# Altium project AM3359.PRJPCB (part 2 of 2)

## Sheet Sheet7.SchDoc
size B
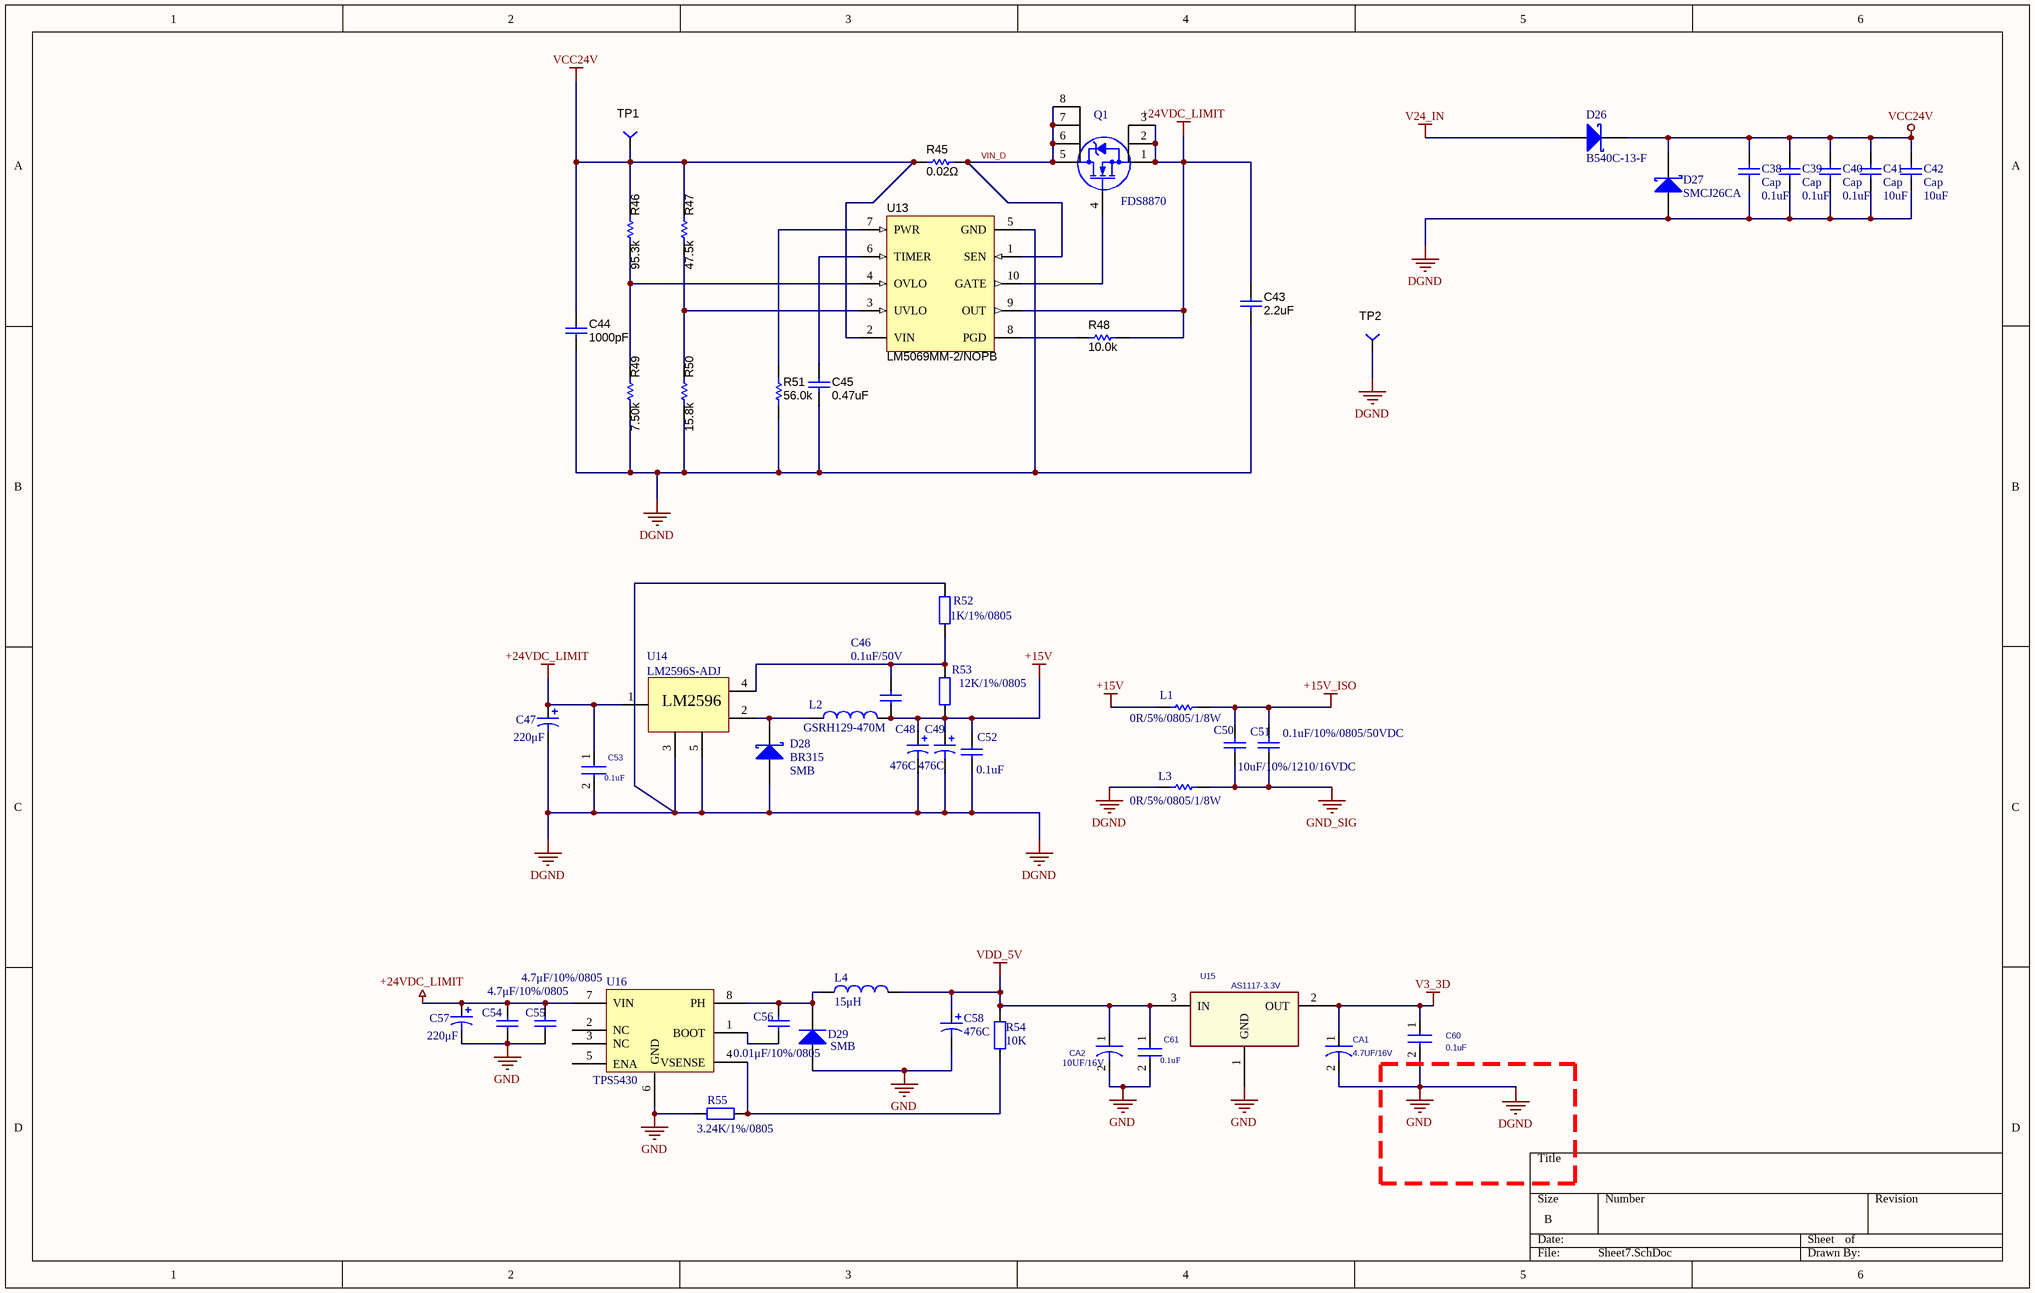
[diagram p6: Sheet7.SchDoc]

### Parts
C38  Cap  value 0.1uF  [0805_cap]
C39  Cap  value 0.1uF  [0805_cap]
C40  Cap  value 0.1uF  [0805_cap]
C41  Cap  value 10uF  [0805_cap]
C42  Cap  value 10uF  [0805_cap]
C43  ValueDisplayed: 2.2uF  [1210]  (hidden comment: GRM32ER72A225KA35L)
C44  ValueDisplayed: 1000pF  [0805_cap]  (hidden comment: 06031C102JAT2A)
C45  ValueDisplayed: 0.47uF  [0805_cap]  (hidden comment: UMK107ABJ474KA-T)
C46  0.1uF/50V  [C-0805]
C47  220μF  [CZ3.0/6.5]
C48  476C  [7343-43]
C49  476C  [7343-43]
C50  10uF/10%/1210/16VDC  [C-1210]
C51  0.1uF/10%/0805/50VDC  [C-0805]
C52  0.1uF  [C-0805]
C53  0.1uF  [0805_CAP]
C54  4.7μF/10%/0805  [0805_CAP]
C55  4.7μF/10%/0805  [0805_CAP]
C56  0.01μF/10%/0805  [0805_CAP]
C57  220μF  [CZ3.0/6.5]
C58  476C  [7343-43]
C60  0.1uF  [0805_CAP]
C61  0.1uF  [0805_CAP]
CA1  4.7UF/16V  [3528cap]
CA2  10UF/16V  [3528cap]
D26  B540C-13-F  [SMB1]
D27  SMCJ26CA  [SMB1]
D28  D Schottky  [SMB]  (value not drawn)
D29  SMB  [SMB]
L1  0R/5%/0805/1/8W  [R-0805]
L2  GSRH129-470M  [GSDS104C2]
L3  0R/5%/0805/1/8W  [R-0805]
L4  15μH  [GSDS104C2]
Q1  FDS8870  [SO-G8]
R45  value 0.02Ω  [1206]  (hidden comment: PRL1632-R020-F-T1)
R46  value 95.3k  [0805]  (hidden comment: CRCW060395K3FKEA)
R47  value 47.5k  [0805]  (hidden comment: CRCW060347K5FKEA)
R48  value 10.0k  [0805]  (hidden comment: CRCW060310K0FKEA)
R49  value 7.50k  [0805]  (hidden comment: CRCW06037K50FKEA)
R50  value 15.8k  [0805]  (hidden comment: CRCW060315K8FKEA)
R51  value 56.0k  [0805]  (hidden comment: RG1608P-563-B-T5)
R52  1K/1%/0805  [0805]
R53  12K/1%/0805  [0805]
R54  10K  [0805]
R55  3.24K/1%/0805  [0805]
TP1  TP-040_RND  [TP-040_RND]  (value not drawn)
TP2  TP-040_RND  [TP-040_RND]  (value not drawn)
U13  LM5069MM-2/NOPB  [MUB10A_N]
U14  LM2596S-ADJ  [TO-263(S)-5]
U15  AS1117-3.3V  [SOT-223]
U16  TPS5430  [SO-G8]

### Nets
+15V: C46.2 C48.1 C49.1 C52.2 L1.1 L2.2 R53.1
+15V_ISO: C50.2 C51.2 L1.2
+24VDC_LIMIT: C43.1 C47.1 C53.1 C54.2 C55.2 C57.1 Q1.1(S) Q1.2(S) Q1.3(S) R48.1 U13.9(OUT) U14.1 U16.7(VIN)
DGND: C38.1 C39.1 C40.1 C41.1 C42.1 C43.2 C44.2 C45.2 C47.2 C48.2 C49.2 C52.1 C53.2 C54.1 C55.1 C57.2 C58.2 C60.2 C61.2 CA1.2 CA2.2 D27.1(A) D28.1(A) D29.1(A) L3.1 R49.1 R50.1 R51.1 R52.2 R55.2 TP2.1 U13.5(GND) U14.3 U14.5 U15.1(GND) U16.6(GND)  [also labelled GND]
GND_SIG: C50.1 C51.1 L3.2
V3_3D: C60.1 CA1.1 U15.2(OUT)
V24_IN: D26.1(A)
VCC24V: C38.2 C39.2 C40.2 C41.2 C42.2 C44.1 D26.2(K) D27.2(K) R45.1 R46.2 R47.2 TP1.1 U13.2(VIN)
VDD_5V: C58.1 C61.1 CA2.1 L4.2 R54.2 U15.3(IN)
VIN_D: Q1.5(D) Q1.6(D) Q1.7(D) Q1.8(D) R45.2 U13.1(SEN)
NetC45_1: C45.1 U13.6(TIMER)
NetC46_1: C46.1 R52.1 R53.2 U14.4
NetC56_1: C56.1 U16.1(BOOT)
NetC56_2: C56.2 D29.2(K) L4.1 U16.8(PH)
NetD28_2: D28.2(K) L2.1 U14.2
NetQ1_4: Q1.4(G) U13.10(GATE)
NetR46_1: R46.1 R49.2 U13.4(OVLO)
NetR47_1: R47.1 R50.2 U13.3(UVLO)
NetR48_2: R48.2 U13.8(PGD)
NetR51_2: R51.2 U13.7(PWR)
NetR54_1: R54.1 R55.1 U16.4(VSENSE)

Not connected (* = marked no-connect by the designer): U16 2(NC) 3(NC) 5(ENA)

### Notes on the sheet
- (in symbol D Schottky) BR315; SMB
- (in symbol SWITCHING) LM2596

### Library data of the parts
C38-C42 C46 C52 = Cap: Capacitor; LatestRevisionDate: 17-Jul-2002
  C38-C42: Published: 8-Jun-2000; LatestRevisionNote: Re-released for DXP Platform.; PackageReference: RAD-0.3; Publisher: Altium Limited
C43 = GRM32ER72A225KA35L: CAP, CERM, 2.2uF, 100V, +/-10%, X7R, 1210; Manufacturer: MuRata; Polarized: N; CompType: Capacitor; U/M: EA; Cap_F: 0.0000022; Tolerance_%: 10; ESR_Ohm: 0.007; Value1: 0.007 ohm; VDC_V: 100; IRMS_A: 4.4; TaMin_C: -55; TaMax_C: 125; SymbolVersion: 2008-07-09; Value: 2.2uF; PartNumber: GRM32ER72A225KA35L; PackageReference: 1210; RoHS: Y; Value2: 100V; MountType: SMT; Technology: Ceramic; TempCo: X7R; Cap_Case: 1210; Published: 2008-06-19; Publisher: Texas Instruments; LatestRevisionDate: 2013-11-21; ComponentLink1Description: Datasheet link; ComponentLink1URL: http://search.murata.co.jp/Ceramy/PnsearchViewAction.do?HnOFG=ON&HnNFG=ON&SEL_CNT=50&sLang=en&sKey=GRM32ER72A225KA35L&x=9&y=9&search=startwith; Supplier 1: Digi-Key; Supplier Part Number 1: 490-3385-1-ND; Supplier 2: Mouser; Supplier Part Number 2: 81-GRM32ER72A225KA35; Supplier 3: Farnell; Supplier Part Number 3: 1735547
C44 = 06031C102JAT2A: CAP, CERM, 1000pF, 100V, +/-5%, X7R, 0603; Manufacturer: AVX; Polarized: N; CompType: Capacitor; U/M: EA; Cap_F: 0.000000001; Tolerance_%: 5; ESR_Ohm: 0.276; Value1: 0.276 ohm; VDC_V: 100; TaMin_C: -55; TaMax_C: 125; Cap_Case: 0603; SymbolVersion: 2008-07-09; Value: 1000pF; PartNumber: 06031C102JAT2A; PackageReference: 0603; RoHS: Y; Value2: 100V; MountType: SMT; Technology: Ceramic; TempCo: X7R; Published: 2008-06-19; Publisher: Texas Instruments; LatestRevisionDate: 2013-11-21; ComponentLink1Description: Datasheet link; ComponentLink1URL: http://www.avx.com/docs/masterpubs/smccp.pdf; Supplier 1: Digi-Key; Supplier Part Number 1: 478-3698-1-ND; Supplier 2: Mouser; Supplier Part Number 2: 581-06031C102J; Supplier 3: Farnell; Supplier Part Number 3: 1740627
C45 = UMK107ABJ474KA-T: CAP, CERM, 0.47uF, 50V, 10%, X5R, 0603; Manufacturer: Taiyo Yuden; Polarized: N; CompType: Capacitor; Cap_F: 0.00000047; Tolerance_%: 10; VDC_V: 50; Cap_Case: 0603; Value: 0.47uF; PartNumber: UMK107ABJ474KA-T; PackageReference: 0603; RoHS: Y; Value2: 50V; MountType: SMT; Technology: Ceramic; TempCo: X5R; Publisher: Texas Instruments; ComponentLink1Description: Datasheet link; ComponentLink1URL: http://www.yuden.co.jp/productdata/catalog/en/mlcc101_e.pdf; Supplier 1: Digi-Key; Supplier Part Number 1: 587-3171-6-ND
C47 C57 = Cap Pol1: Polarized Capacitor (Radial); Value: 1uF; Published: 8-Jun-2000; LatestRevisionDate: 17-Jul-2002; LatestRevisionNote: Re-released for DXP Platform.; PackageReference: RB7.6-15; Publisher: Altium Limited; PackageDescription: Polarized Capacitor (Radial); 2 Leads
C48 C49 C58 = Cap Pol1: Polarized Capacitor (Radial); Value: 2.2uF; Published: 8-Jun-2000; LatestRevisionDate: 17-Jul-2002; LatestRevisionNote: Re-released for DXP Platform.; PackageReference: RB7.6-15; Publisher: Altium Limited; PackageDescription: Polarized Capacitor (Radial); 2 Leads
C50 = ASC-0024CA: 名称: 贴片电容; 型号: CGA6P3X8R1C106K250AB; 品牌: TDK; 规格: 10uF/10%/1210/16VDC
C51 = ASC-0024CA: 名称: 贴片电容; 型号: CGA4J2X8R1H104K125AA; 品牌: TDK; 规格: 0.1uF/10%/0805/50VDC
C53 C60 C61 = C
C54-C56 = Cap: Capacitor; Value: 0.01uF; Published: 8-Jun-2000; LatestRevisionDate: 17-Jul-2002; LatestRevisionNote: Re-released for DXP Platform.; PackageReference: RAD-0.3; Publisher: Altium Limited; PackageDescription: Radial Cap, Thru-Hole; 2 Leads; 0.3 in Pin Spacing
CA1 CA2 = ECAP
D26 D27 = D Schottky: Schottky Diode; Published: 8-Jun-2000; LatestRevisionDate: 17-Jul-2002; LatestRevisionNote: Re-released for DXP Platform.; PackageReference: SMB; Publisher: Altium Limited; Code_JEDEC: DO-214-AA
D29 = Diode 1N5408: 3 Amp Medium Power Silicon Rectifier Diode; Published: 8-Jun-2000; LatestRevisionDate: 17-Jul-2002; LatestRevisionNote: Re-released for DXP Platform.; DatasheetVersion: Aug-1984; PackageReference: DO-201AD; Publisher: Altium Limited; PackageDescription: Diode, Axial; Body 9.5 x 5.3 mm (LxDia. max), Lead Dia. 1.32 mm (max); ComponentLink1Description: Manufacturer Link; ComponentLink1URL: http://www.irf.com/
L1 L3 = ASR-0010AA: 名称: 贴片电阻; 型号: RC0805JR-070RL; 品牌: YAGEO; 原编码: S-064-GX; OK?: □; Part Number: ASR-0010AA; 规格: 0R/5%/0805/1/8W
L2 = Inductor
L4 = Inductor: Code_IEC: 1005; Value: 10mH; Published: 8-Jun-2000; LatestRevisionDate: 29-May-2009; LatestRevisionNote: IPC-7351 Footprint Added.; PackageReference: 0402-A; Publisher: Altium Limited; PackageDescription: Chip Inductor; Code_JEITA: 0402
Q1 = MOSFET_N_8
R45 = PRL1632-R020-F-T1: RES, 0.02 ohm, 1%, 1W, 1206; Manufacturer: Susumu Co Ltd; CompType: Resistor; Res_ohm: 0.02; Value_Code: R020; Tolerance_%: 1; TempCo: 100 ppm/C; EIA_Code: E96; U/M: EA; SymbolVersion: 2009-05-29; PartNumber: PRL1632-R020-F-T1; PackageReference: 1206; RoHS: Y; Value1: 1%; Power_W: 1; Value2: 1W; MountType: SMT; Technology: Thin Film; Published: 2008-06-26; Publisher: Texas Instruments; LatestRevisionDate: 2013-10-09; ComponentLink1Description: Datasheet link; ComponentLink1URL: http://www.susumu.co.jp/english/pdf/products-j01-07.pdf; Supplier 1: Digi-Key; Supplier Part Number 1: PRL1632.020FCT-ND; Supplier 2: Mouser; Supplier Part Number 2: 754-PRL1632-R020-FT1; Supplier 3: Farnell; Supplier Part Number 3: 1268779
R46 = CRCW060395K3FKEA: RES, 95.3k ohm, 1%, 0.1W, 0603; Manufacturer: Vishay-Dale; CompType: Resistor; Res_ohm: 95300; Value_Code: 95k3; Tolerance_%: 1; Power_W: 0.1; VDC_V: 75; TempCo: 100 ppm/C; EIA_Code: E96; U/M: EA; SymbolVersion: 2009-05-29; PartNumber: CRCW060395K3FKEA; PackageReference: 0603; RoHS: Y; Value1: 1%; Value2: 0.1W; MountType: SMT; Technology: Thick Film; Published: 2008-06-26; Publisher: Texas Instruments; LatestRevisionDate: 2013-10-22; ComponentLink1Description: Datasheet link; ComponentLink1URL: http://www.vishay.com/docs/20035/dcrcwe3.pdf; Supplier 1: Digi-Key; Supplier Part Number 1: 541-95.3KHCT-ND; Supplier 2: Mouser; Supplier Part Number 2: 71-CRCW0603-95.3K-E3; Supplier 3: Farnell; Supplier Part Number 3: 1152173
R47 = CRCW060347K5FKEA: RES, 47.5k ohm, 1%, 0.1W, 0603; Manufacturer: Vishay-Dale; CompType: Resistor; Res_ohm: 47500; Value_Code: 47k5; Tolerance_%: 1; Power_W: 0.1; VDC_V: 75; TempCo: 100 ppm/C; EIA_Code: E96; U/M: EA; SymbolVersion: 2009-05-29; PartNumber: CRCW060347K5FKEA; PackageReference: 0603; RoHS: Y; Value1: 1%; Value2: 0.1W; MountType: SMT; Technology: Thick Film; Published: 2008-06-26; Publisher: Texas Instruments; LatestRevisionDate: 2013-10-22; ComponentLink1Description: Datasheet link; ComponentLink1URL: http://www.vishay.com/docs/20035/dcrcwe3.pdf; Supplier 1: Digi-Key; Supplier Part Number 1: 541-47.5KHCT-ND; Supplier 2: Mouser; Supplier Part Number 2: 71-CRCW0603-47.5K-E3; Supplier 3: Farnell; Supplier Part Number 3: 1469813
R48 = CRCW060310K0FKEA: RES, 10.0k ohm, 1%, 0.1W, 0603; Manufacturer: Vishay-Dale; CompType: Resistor; Res_ohm: 10000; Value_Code: 10k0; Tolerance_%: 1; Power_W: 0.1; VDC_V: 75; TempCo: 100 ppm/C; EIA_Code: E96; U/M: EA; SymbolVersion: 2009-05-29; PartNumber: CRCW060310K0FKEA; PackageReference: 0603; RoHS: Y; Value1: 1%; Value2: 0.1W; MountType: SMT; Technology: Thick Film; Published: 2008-06-26; Publisher: Texas Instruments; LatestRevisionDate: 2013-10-22; ComponentLink1Description: Datasheet link; ComponentLink1URL: http://www.vishay.com/docs/20035/dcrcwe3.pdf; Supplier 1: Digi-Key; Supplier Part Number 1: 541-10.0KHCT-ND; Supplier 2: Mouser; Supplier Part Number 2: 71-CRCW0603-10K-E3; Supplier 3: Farnell; Supplier Part Number 3: 1469748
R49 = CRCW06037K50FKEA: RES, 7.50k ohm, 1%, 0.1W, 0603; Manufacturer: Vishay-Dale; CompType: Resistor; Res_ohm: 7500; Value_Code: 7k50; Tolerance_%: 1; Power_W: 0.1; VDC_V: 75; TempCo: 100 ppm/C; EIA_Code: E96; U/M: EA; SymbolVersion: 2009-05-29; PartNumber: CRCW06037K50FKEA; PackageReference: 0603; RoHS: Y; Value1: 1%; Value2: 0.1W; MountType: SMT; Technology: Thick Film; Published: 2008-06-26; Publisher: Texas Instruments; LatestRevisionDate: 2013-10-22; ComponentLink1Description: Datasheet link; ComponentLink1URL: http://www.vishay.com/docs/20035/dcrcwe3.pdf; Supplier 1: Digi-Key; Supplier Part Number 1: 541-7.50KHCT-ND; Supplier 2: Mouser; Supplier Part Number 2: 71-CRCW0603-7.5K-E3; Supplier 3: Farnell; Supplier Part Number 3: 1469835
R50 = CRCW060315K8FKEA: RES, 15.8k ohm, 1%, 0.1W, 0603; Manufacturer: Vishay-Dale; CompType: Resistor; Res_ohm: 15800; Value_Code: 15k8; Tolerance_%: 1; Power_W: 0.1; VDC_V: 75; TempCo: 100 ppm/C; EIA_Code: E96; U/M: EA; SymbolVersion: 2009-05-29; PartNumber: CRCW060315K8FKEA; PackageReference: 0603; RoHS: Y; Value1: 1%; Value2: 0.1W; MountType: SMT; Technology: Thick Film; Published: 2008-06-26; Publisher: Texas Instruments; LatestRevisionDate: 2013-10-22; ComponentLink1Description: Datasheet link; ComponentLink1URL: http://www.vishay.com/docs/20035/dcrcwe3.pdf; Supplier 1: Digi-Key; Supplier Part Number 1: 541-15.8KHCT-ND; Supplier 2: Mouser; Supplier Part Number 2: 71-CRCW0603-15.8K-E3; Supplier 3: Farnell; Supplier Part Number 3: 1151707
R51 = RG1608P-563-B-T5: RES, 56.0k ohm, 0.1%, 0.1W, 0603; Manufacturer: Susumu Co Ltd; CompType: Resistor; Res_ohm: 56000; Value_Code: 56k0; Tolerance_%: 0.1; VDC_V: 75; TempCo: 25 ppm/C; U/M: EA; SymbolVersion: 2009-05-29; PartNumber: RG1608P-563-B-T5; PackageReference: 0603; RoHS: Y; Value1: 0.1%; Power_W: 0.1; Value2: 0.1W; MountType: SMT; Technology: Metal Film; Published: 2008-06-26; Publisher: Texas Instruments; LatestRevisionDate: 2013-10-22; ComponentLink1Description: Datasheet link; ComponentLink1URL: http://www.susumu.co.jp/english/pdf/products-j01-01.pdf; Supplier 1: Digi-Key; Supplier Part Number 1: RG16P56.0KBCT-ND; Supplier 2: Mouser; Supplier Part Number 2: 754-RG1608P-563-BT5
R52 R55 = Res2: Resistor; Value: 1K; Published: 8-Jun-2000; LatestRevisionDate: 17-Jul-2002; LatestRevisionNote: Re-released for DXP Platform.; PackageReference: AXIAL-0.4; Publisher: Altium Limited
  R55: PackageDescription: Axial Device, Thru-Hole; 2 Leads; 0.4 in Pin Spacing
R53 = Res2: Resistor; Value: 3.1K; Published: 8-Jun-2000; LatestRevisionDate: 17-Jul-2002; LatestRevisionNote: Re-released for DXP Platform.; PackageReference: AXIAL-0.4; Publisher: Altium Limited
R54 = Res2: Resistor; Value: 100K; Published: 8-Jun-2000; LatestRevisionDate: 17-Jul-2002; LatestRevisionNote: Re-released for DXP Platform.; PackageReference: AXIAL-0.4; Publisher: Altium Limited; PackageDescription: Axial Device, Thru-Hole; 2 Leads; 0.4 in Pin Spacing
TP1 TP2 = TP-040_RND: Test Point, O.040 Hole; Manufacturer: Standard; Value: TP-040; area: *; SymbolVersion: 06/30/2008 16:03:57; PartNumber: Standard; ComponentLink1Description: AEO Datasheet Link
U13 = LM5069MM-2/NOPB: Positive High Voltage Hot Swap / Inrush Current Controller with Power Limiting, 10-pin MSOP, Pb-Free; Manufacturer: National Semiconductor; PackageTopMarking: ZXTT*SNBB; PowerWise: N; CompType: MiscPower; Published: 1-Mar-2010; DatasheetVersion: Mar-2008; PackageVersion: revB, Jul-2003; PackageReference: MUB10A; Publisher: Altium Limited; PackageDescription: Mini-SO, Molded, .118 x .118 x .034in Body, 10 Lead, .0197in Pitch; Supplier 1: Digi-Key; Supplier Part Number 1: LM5069MM-2TR-ND; Supplier 2: Digi-Key; Supplier Part Number 2: LM5069MM-2CT-ND; Supplier 3: Digi-Key; Supplier Part Number 3: LM5069MM-2DKR-ND; Supplier 4: Farnell; Supplier Part Number 4: 1654265; PartNumber: LM5069MM-2/NOPB; RoHS: Y; PinCount: 10; Code_JEDEC: MO-187-BA; ComponentLink1Description: LM5069 Datasheet; ComponentLink1URL: http://www.national.com/ds/LM/LM5069.pdf; ComponentLink2Description: LM5069 Web Page; ComponentLink2URL: http://www.national.com/pf/LM/LM5069.html; ComponentLink3Description: MUB10A Package Page; ComponentLink3URL: http://www.national.com/packaging/folders/mub10a.html
U14 = SWITCHING
U15 = AS1117

## Nets that join several sheets
+15V_ISO: Sheet6 (10 pins), Sheet7 (C50.2 C51.2 L1.2)
DGND: Sheet1 (10 pins), Sheet2 (6 pins), Sheet4 (7 pins), Sheet5 (16 pins), Sheet6 (C30.2 ISO1.2 ISO1.8), Sheet7 (36 pins)
GND_SIG: Sheet1 (P4.27 P4.28), Sheet5 (8 pins), Sheet6 (44 pins), Sheet7 (C50.1 C51.1 L3.2)
V3_3D: Sheet2 (8 pins), Sheet4 (C5.2 U3.24), Sheet5 (14 pins), Sheet6 (C30.1 ISO1.1 ISO1.7), Sheet7 (C60.1 CA1.1 U15.2)
V24_IN: Sheet1 (P4.31), Sheet7 (D26.1)
VCC24V: Sheet2 (D1.1 D2.1), Sheet4 (34 pins), Sheet7 (13 pins)
VDD_5V: Sheet1 (P1.5 P1.6), Sheet7 (6 pins)
AD_~{RDY}: Sheet1 (P2.7), Sheet5 (U5.2)
CANRX: Sheet1 (P1.26), Sheet5 (U8.4)
CANTX: Sheet1 (P1.24), Sheet5 (U8.1)
COM1: Sheet1 (P4.9), Sheet4 (8 pins)
ENABLE1: Sheet1 (P1.16), Sheet5 (U7.2 U7.3)
ENABLE2: Sheet1 (P1.23), Sheet5 (U9.2 U9.3)
GPIO_20: Sheet1 (P1.41), Sheet2 (U1.29 U2.29)
I2C2_SCL: Sheet1 (P1.19), Sheet4 (U3.22), Sheet5 (R31.2 U5.10)
I2C2_SDA: Sheet1 (P1.20), Sheet4 (U3.23), Sheet5 (R32.2 U5.9)
IN_PIN0: Sheet1 (P3.1), Sheet2 (U1.5)
IN_PIN1: Sheet1 (P3.2), Sheet2 (U1.6)
IN_PIN2: Sheet1 (P3.3), Sheet2 (U1.7)
IN_PIN3: Sheet1 (P3.4), Sheet2 (U1.8)
IN_PIN4: Sheet1 (P3.5), Sheet2 (U1.25)
IN_PIN5: Sheet1 (P3.6), Sheet2 (U1.26)
IN_PIN6: Sheet1 (P3.7), Sheet2 (U1.27)
IN_PIN7: Sheet1 (P3.8), Sheet2 (U1.28)
IN_PIN8: Sheet1 (P3.9), Sheet2 (U1.9)
IN_PIN9: Sheet1 (P3.10), Sheet2 (U1.10)
IN_PIN10: Sheet1 (P3.11), Sheet2 (U1.11)
IN_PIN11: Sheet1 (P3.12), Sheet2 (U1.12)
IN_PIN12: Sheet1 (P3.13), Sheet2 (U1.13)
IN_PIN13: Sheet1 (P3.14), Sheet2 (U1.14)
IN_PIN14: Sheet1 (P3.15), Sheet2 (U1.15)
IN_PIN15: Sheet1 (P3.16), Sheet2 (U1.24)
IN_PIN16: Sheet1 (P3.17), Sheet2 (U2.5)
IN_PIN17: Sheet1 (P3.18), Sheet2 (U2.6)
IN_PIN18: Sheet1 (P3.19), Sheet2 (U2.7)
IN_PIN19: Sheet1 (P3.20), Sheet2 (U2.8)
IN_PIN20: Sheet1 (P3.21), Sheet2 (U2.25)
IN_PIN21: Sheet1 (P3.22), Sheet2 (U2.26)
IN_PIN22: Sheet1 (P3.23), Sheet2 (U2.27)
IN_PIN23: Sheet1 (P3.24), Sheet2 (U2.28)
IN_PIN24: Sheet1 (P3.25), Sheet2 (U2.9)
IN_PIN25: Sheet1 (P3.26), Sheet2 (U2.10)
IN_PIN26: Sheet1 (P3.27), Sheet2 (U2.11)
IN_PIN27: Sheet1 (P3.28), Sheet2 (U2.12)
IN_PIN28: Sheet1 (P3.29), Sheet2 (U2.13)
IN_PIN29: Sheet1 (P3.30), Sheet2 (U2.14)
IN_PIN30: Sheet1 (P3.31), Sheet2 (U2.15)
IN_PIN31: Sheet1 (P3.32), Sheet2 (U2.24)
OUT_~{CS}: Sheet1 (P1.15), Sheet6 (ISO1.3)
OUT_PIN0: Sheet1 (P4.1), Sheet4 (K1.1)
OUT_PIN1: Sheet1 (P4.2), Sheet4 (K3.1)
OUT_PIN2: Sheet1 (P4.3), Sheet4 (K5.1)
OUT_PIN3: Sheet1 (P4.4), Sheet4 (K7.1)
OUT_PIN4: Sheet1 (P4.5), Sheet4 (K9.1)
OUT_PIN5: Sheet1 (P4.6), Sheet4 (K11.1)
OUT_PIN6: Sheet1 (P4.7), Sheet4 (K13.1)
OUT_PIN7: Sheet1 (P4.8), Sheet4 (K15.1)
OUT_PIN8: Sheet1 (P4.11), Sheet4 (K2.1)
OUT_PIN9: Sheet1 (P4.12), Sheet4 (K2.2)
OUT_PIN10: Sheet1 (P4.13), Sheet4 (K4.1)
OUT_PIN11: Sheet1 (P4.14), Sheet4 (K4.2)
OUT_PIN12: Sheet1 (P4.15), Sheet4 (K6.1)
OUT_PIN13: Sheet1 (P4.16), Sheet4 (K6.2)
OUT_PIN14: Sheet1 (P4.17), Sheet4 (K8.1)
OUT_PIN15: Sheet1 (P4.18), Sheet4 (K8.2)
OUT_PIN16: Sheet1 (P4.19), Sheet4 (K10.1)
OUT_PIN17: Sheet1 (P4.20), Sheet4 (K10.2)
OUT_PIN18: Sheet1 (P4.21), Sheet4 (K12.1)
OUT_PIN19: Sheet1 (P4.22), Sheet4 (K12.2)
OUT_PIN20: Sheet1 (P4.23), Sheet4 (K14.1)
OUT_PIN21: Sheet1 (P4.24), Sheet4 (K14.2)
OUT_PIN22: Sheet1 (P4.25), Sheet4 (K16.1)
OUT_PIN23: Sheet1 (P4.26), Sheet4 (K16.2)
PA0: Sheet1 (P2.14), Sheet4 (U3.4 U4.1)
PA1: Sheet1 (P2.13), Sheet4 (U3.5 U4.2)
PA2: Sheet1 (P2.12), Sheet4 (U3.6 U4.3)
PA3: Sheet1 (P2.11), Sheet4 (U3.7 U4.4)
PA4: Sheet1 (P2.10), Sheet4 (U3.8 U4.5)
PA5: Sheet1 (P2.9), Sheet4 (U3.9 U4.6)
PA6: Sheet1 (P2.8), Sheet4 (U3.10 U4.7)
PB0: Sheet1 (P2.15), Sheet4 (U3.13 U6.1)
PB1: Sheet1 (P2.16), Sheet4 (U3.14 U6.2)
PB2: Sheet1 (P2.17), Sheet4 (U3.15 U6.3)
PB3: Sheet1 (P2.18), Sheet4 (U3.16 U6.4)
PB4: Sheet1 (P2.19), Sheet4 (U3.17 U6.5)
PB5: Sheet1 (P2.20), Sheet4 (U3.18 U6.6)
PB6: Sheet1 (P2.21), Sheet4 (U3.19 U6.7)
PB7: Sheet1 (P2.26), Sheet4 (U3.20 U6.8)
SPI0_CS0: Sheet1 (P1.17), Sheet2 (U1.4 U2.4)
SPI0_MISO: Sheet1 (P1.21), Sheet2 (U2.32), Sheet6 (ISO1.6)
SPI0_MOSI: Sheet1 (P1.18), Sheet2 (U1.2), Sheet6 (ISO1.5)
SPI0_SCLK: Sheet1 (P1.22), Sheet2 (U1.3 U2.3), Sheet6 (ISO1.4)
UART3_RX: Sheet1 (P1.12), Sheet5 (R19.1 U7.1)
UART3_TX: Sheet1 (P1.14), Sheet5 (U7.4)
UART4_RX: Sheet1 (P1.25), Sheet5 (R27.1 U9.1)
UART4_TX: Sheet1 (P1.27), Sheet5 (U9.4)
VOUT1: Sheet1 (P4.29), Sheet6 (C23.1 D21.1 FB1.2)
VOUT2: Sheet1 (P4.30), Sheet6 (C34.1 D24.1 FB2.2)